# Altium schematic sheet Endings.SchDoc
size A4; SheetNumber: 11; SheetTotal: 11
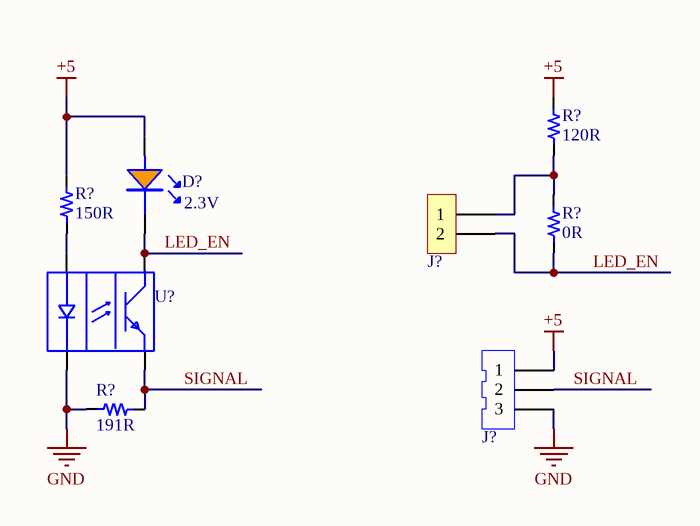
[diagram p0: Endings.SchDoc]

## Parts
(Parts that share a designator on the sheet are numbered #1, #2 ... from top to bottom, then left to right.)
D?  2.3V  [0805_LED]
J?#1  2x1  [H_2x1_TH_100mil]  (value not drawn)  (no BOM)
J?#2  CONN HEADER TH 3POS 2.5mm  (value not drawn)
R?#1  value 120R  [0603_res]  (hidden comment: 120R 1/10W)
R?#2  value 150R  [0603_res]  (hidden comment: 150R 1/10W)
R?#3  value 0R  [0603_res]  (hidden comment: 0R 1/10W)
R?#4  value 191R  [0603_res]  (hidden comment: 191R 1/10W)
U?  SENSOR OPT SLOT PHOTOTRAN PCB MT  [RES_0402]  (value not drawn)

## Nets
+5: D?.1(A) J?#2.1 R?#1.2 R?#2.2
GND: J?#2.3 R?#4.1 U?.1(CATHODE)
LED_EN: D?.2 J?#1.2 R?#3.1 U?.3(COLLECTOR)
SIGNAL: J?#2.2 R?#4.2 U?.4(EMISOR)
NetJ?#1_1: J?#1.1 R?#1.1 R?#3.2
NetR?#2_1: R?#2.1 U?.2(ANODE)

## Library data of the parts
D? = LED_0805_Orange: LED ORANGE WATER CLEAR 0805 SMD; Manufacturer: XINGLIGHT; Manufacturer Part Number: XL-2012UOC; Supplier 1: LCSC; Supplier Part Number 1: C965813; ComponentLink1Description: LCSC; ComponentLink1URL: https://www.lcsc.com/product-detail/C965813.html?s_z=n_XINGLIGHT%2520XL-2012
J?#1 = H_Male_2x1_TH_100mil: ComponentLink1Description: LCSC
J?#2 = Connector JST 3pin: 3P 1x3P XH Tin -25℃~+85℃ White 2.5mm 250V 3 3A 1 Through Hole Through Hole,P=2.5mm Headers, Male Pins RoHS; Manufacturer: JST; Manufacturer Part Number: B3B-XH-A(LF)(SN); Supplier 1: LCSC; Supplier Part Number 1: C144394; ComponentLink1Description: LCSC; ComponentLink1URL: https://www.lcsc.com/product-detail/C144394.html?s_z=n_JST%2520b3
R?#1 = Res_120R_0603_1/10W: 100mW Thick Film Resistor 75V ±100ppm/℃ ±1% 120Ω 0603 Chip Resistor - Surface Mount ROHS; Manufacturer: FOJAN; Manufacturer Part Number: FRC0603F1200TS; ComponentLink1URL: https://lcsc.com/product-detail/Chip-Resistor-Surface-Mount_FOJAN-FRC0603F1200TS_C2906988.html; Supplier 1: LCSC; Supplier Part Number 1: C2906988; ComponentLink1Description: LCSC
R?#2 = Res_150R_0603_1/10W: 100mW Thick Film Resistor 75V ±100ppm/℃ ±1% 150Ω 0603 Chip Resistor - Surface Mount ROHS; Manufacturer: RALEC; Manufacturer Part Number: RTT031500FTP; ComponentLink1URL: https://lcsc.com/product-detail/Chip-Resistor-Surface-Mount_RALEC-RTT031500FTP_C103302.html; Supplier 1: LCSC; Supplier Part Number 1: C103302; ComponentLink1Description: LCSC
R?#3 = Res_0R_0603_1/10W: RES SMD 0R OHM 5% 1/10W 0603; Manufacturer: FOJAN; Manufacturer Part Number: FRC0603P000 TS; ComponentLink1URL: https://www.lcsc.com/product-detail/Chip-Resistor-Surface-Mount_FOJAN-FRC0603P000-TS_C2907080.html; Supplier 1: LCSC; Supplier Part Number 1: C2907080; ComponentLink1Description: LCSC
R?#4 = Res_191R_0603_1/10W: 100mW Thick Film Resistor 75V ±100ppm/℃ ±1% 191Ω 0603 Chip Resistor - Surface Mount ROHS; Manufacturer: FOJAN; Manufacturer Part Number: FRC0603F1910TS; ComponentLink1URL: https://lcsc.com/product-detail/Chip-Resistor-Surface-Mount_FOJAN-FRC0603F1910TS_C3000718.html; Supplier 1: LCSC; Supplier Part Number 1: C3000718; ComponentLink1Description: LCSC
U? = RPI-441C1E: 850nm 1.4V DIP-4 Photointerrupters - Slot Type - Transistor Output RoHS; Manufacturer: ROHM; Supplier 1: LCSC; Supplier Part Number 1: C919442; Manufacturer Part Number: RPI-441C1E; ComponentLink1Description: LCSC; ComponentLink1URL: https://www.lcsc.com/product-detail/C919442.html?s_z=n_RPI-441C1